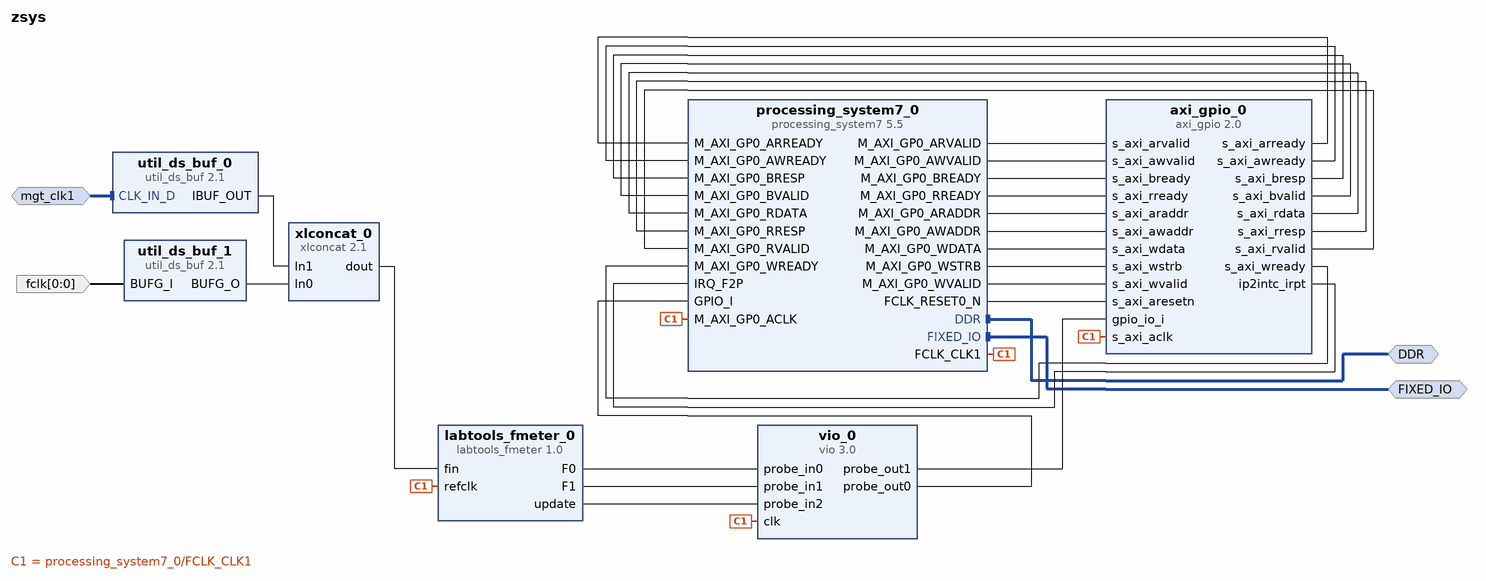
[diagram p0: block diagram of the top level]
# Vivado block design zsys, xc7z015clg485-1, Vivado 2017.2.1
create_bd_design zsys

create_bd_intf_port -mode Slave -vlnv xilinx.com:interface:diff_clock_rtl:1.0 mgt_clk1
set_property -dict {CONFIG.FREQ_HZ 125000000} [get_bd_intf_ports mgt_clk1]
create_bd_intf_port -mode Master -vlnv xilinx.com:interface:ddrx_rtl:1.0 DDR
create_bd_intf_port -mode Master -vlnv xilinx.com:display_processing_system7:fixedio_rtl:1.0 FIXED_IO
create_bd_port -dir I -from 0 -to 0 -type clk fclk
set_property -dict {CONFIG.FREQ_HZ 125000000} [get_bd_ports fclk]

create_bd_cell -type ip -vlnv trenz.biz:user:labtools_fmeter:1.0 labtools_fmeter_0
set_property -dict {CONFIG.C_CHANNELS 2} [get_bd_cells labtools_fmeter_0]
create_bd_cell -type ip -vlnv xilinx.com:ip:processing_system7:5.5 processing_system7_0
set_property -dict [list \
  CONFIG.PCW_FCLK_CLK1_BUF TRUE \
  CONFIG.PCW_I2C_PERIPHERAL_FREQMHZ 111.111115 \
  CONFIG.PCW_FPGA1_PERIPHERAL_FREQMHZ 100 \
  CONFIG.PCW_USE_AXI_NONSECURE 1 \
  CONFIG.PCW_USE_FABRIC_INTERRUPT 1 \
  CONFIG.PCW_EN_CLK1_PORT 1 \
  CONFIG.PCW_IRQ_F2P_INTR 1 \
  CONFIG.PCW_PRESET_BANK1_VOLTAGE {LVCMOS 1.8V} \
  CONFIG.PCW_UIPARAM_DDR_MEMORY_TYPE {DDR 3 (Low Voltage)} \
  CONFIG.PCW_UIPARAM_DDR_PARTNO {MT41J256M16 RE-125} \
  CONFIG.PCW_QSPI_PERIPHERAL_ENABLE 1 \
  CONFIG.PCW_QSPI_QSPI_IO {MIO 1 .. 6} \
  CONFIG.PCW_QSPI_GRP_SINGLE_SS_ENABLE 1 \
  CONFIG.PCW_QSPI_GRP_SINGLE_SS_IO {MIO 1 .. 6} \
  CONFIG.PCW_QSPI_GRP_FBCLK_ENABLE 1 \
  CONFIG.PCW_QSPI_GRP_FBCLK_IO {MIO 8} \
  CONFIG.PCW_ENET0_PERIPHERAL_ENABLE 1 \
  CONFIG.PCW_ENET0_ENET0_IO {MIO 16 .. 27} \
  CONFIG.PCW_ENET0_GRP_MDIO_ENABLE 1 \
  CONFIG.PCW_ENET0_GRP_MDIO_IO {MIO 52 .. 53} \
  CONFIG.PCW_ENET_RESET_ENABLE 1 \
  CONFIG.PCW_ENET_RESET_SELECT {Share reset pin} \
  CONFIG.PCW_ENET0_RESET_ENABLE 1 \
  CONFIG.PCW_ENET0_RESET_IO {MIO 50} \
  CONFIG.PCW_SD0_PERIPHERAL_ENABLE 1 \
  CONFIG.PCW_SD0_SD0_IO {MIO 40 .. 45} \
  CONFIG.PCW_UART0_PERIPHERAL_ENABLE 1 \
  CONFIG.PCW_UART0_UART0_IO {MIO 14 .. 15} \
  CONFIG.PCW_UART1_PERIPHERAL_ENABLE 0 \
  CONFIG.PCW_TTC0_PERIPHERAL_ENABLE 1 \
  CONFIG.PCW_TTC0_TTC0_IO EMIO \
  CONFIG.PCW_TTC1_PERIPHERAL_ENABLE 1 \
  CONFIG.PCW_TTC1_TTC1_IO EMIO \
  CONFIG.PCW_USB0_PERIPHERAL_ENABLE 1 \
  CONFIG.PCW_USB0_USB0_IO {MIO 28 .. 39} \
  CONFIG.PCW_USB_RESET_ENABLE 1 \
  CONFIG.PCW_USB_RESET_SELECT {Share reset pin} \
  CONFIG.PCW_USB0_RESET_ENABLE 1 \
  CONFIG.PCW_USB0_RESET_IO {MIO 51} \
  CONFIG.PCW_I2C0_PERIPHERAL_ENABLE 1 \
  CONFIG.PCW_I2C0_I2C0_IO EMIO \
  CONFIG.PCW_I2C1_PERIPHERAL_ENABLE 1 \
  CONFIG.PCW_I2C1_I2C1_IO {MIO 48 .. 49} \
  CONFIG.PCW_I2C1_GRP_INT_ENABLE 1 \
  CONFIG.PCW_I2C1_GRP_INT_IO EMIO \
  CONFIG.PCW_I2C_RESET_ENABLE 1 \
  CONFIG.PCW_I2C_RESET_SELECT {Share reset pin} \
  CONFIG.PCW_GPIO_MIO_GPIO_ENABLE 1 \
  CONFIG.PCW_GPIO_MIO_GPIO_IO MIO \
  CONFIG.PCW_GPIO_EMIO_GPIO_ENABLE 1 \
  CONFIG.PCW_GPIO_EMIO_GPIO_IO 8 \
  CONFIG.PCW_FPGA_FCLK1_ENABLE 1 \
] [get_bd_cells processing_system7_0]
# 187 more settings of processing_system7_0 are not shown: defaults, MIO pin electricals, DDR timing, and values the tool derives
create_bd_cell -type ip -vlnv xilinx.com:ip:util_ds_buf:2.1 util_ds_buf_0
set_property -dict {CONFIG.USE_BOARD_FLOW true CONFIG.DIFF_CLK_IN_BOARD_INTERFACE mgt_clk1} [get_bd_cells util_ds_buf_0]
create_bd_cell -type ip -vlnv xilinx.com:ip:util_ds_buf:2.1 util_ds_buf_1
set_property -dict {CONFIG.C_BUF_TYPE BUFG} [get_bd_cells util_ds_buf_1]
create_bd_cell -type ip -vlnv xilinx.com:ip:vio:3.0 vio_0
set_property -dict [list \
  CONFIG.C_PROBE_OUT1_WIDTH 8 \
  CONFIG.C_PROBE_OUT0_WIDTH 8 \
  CONFIG.C_NUM_PROBE_OUT 2 \
  CONFIG.C_NUM_PROBE_IN 3 \
] [get_bd_cells vio_0]
create_bd_cell -type ip -vlnv xilinx.com:ip:xlconcat:2.1 xlconcat_0
create_bd_cell -type ip -vlnv xilinx.com:ip:axi_gpio:2.0 axi_gpio_0
set_property -dict [list \
  CONFIG.C_GPIO_WIDTH 8 \
  CONFIG.C_IS_DUAL 0 \
  CONFIG.C_ALL_INPUTS 1 \
  CONFIG.C_INTERRUPT_PRESENT 1 \
] [get_bd_cells axi_gpio_0]

# ---- connections ----

connect_bd_intf_net -intf_net mgt_clk1_1 [get_bd_intf_ports mgt_clk1] [get_bd_intf_pins util_ds_buf_0/CLK_IN_D]
connect_bd_intf_net [get_bd_intf_ports DDR] [get_bd_intf_pins processing_system7_0/DDR]
connect_bd_intf_net [get_bd_intf_ports FIXED_IO] [get_bd_intf_pins processing_system7_0/FIXED_IO]
connect_bd_net -net BUFG_I_1 [get_bd_ports fclk] [get_bd_pins util_ds_buf_1/BUFG_I]
connect_bd_net -net fm_fclk125 [get_bd_pins labtools_fmeter_0/F0] [get_bd_pins vio_0/probe_in0]
connect_bd_net -net fm_mgt1 [get_bd_pins labtools_fmeter_0/F1] [get_bd_pins vio_0/probe_in1]
connect_bd_net [get_bd_pins labtools_fmeter_0/update] [get_bd_pins vio_0/probe_in2]
connect_bd_net [get_bd_pins processing_system7_0/FCLK_CLK1] \
  [get_bd_pins labtools_fmeter_0/refclk] [get_bd_pins vio_0/clk] [get_bd_pins processing_system7_0/M_AXI_GP0_ACLK] \
  [get_bd_pins axi_gpio_0/s_axi_aclk]
connect_bd_net [get_bd_pins util_ds_buf_0/IBUF_OUT] [get_bd_pins xlconcat_0/In1]
connect_bd_net [get_bd_pins util_ds_buf_1/BUFG_O] [get_bd_pins xlconcat_0/In0]
connect_bd_net [get_bd_pins xlconcat_0/dout] [get_bd_pins labtools_fmeter_0/fin]
connect_bd_net [get_bd_pins vio_0/probe_out0] [get_bd_pins processing_system7_0/GPIO_I]
connect_bd_net [get_bd_pins processing_system7_0/M_AXI_GP0_ARVALID] [get_bd_pins axi_gpio_0/s_axi_arvalid]
connect_bd_net [get_bd_pins processing_system7_0/M_AXI_GP0_AWVALID] [get_bd_pins axi_gpio_0/s_axi_awvalid]
connect_bd_net [get_bd_pins processing_system7_0/M_AXI_GP0_BREADY] [get_bd_pins axi_gpio_0/s_axi_bready]
connect_bd_net [get_bd_pins processing_system7_0/M_AXI_GP0_RREADY] [get_bd_pins axi_gpio_0/s_axi_rready]
connect_bd_net [get_bd_pins processing_system7_0/M_AXI_GP0_ARADDR] [get_bd_pins axi_gpio_0/s_axi_araddr]
connect_bd_net [get_bd_pins axi_gpio_0/s_axi_arready] [get_bd_pins processing_system7_0/M_AXI_GP0_ARREADY]
connect_bd_net [get_bd_pins processing_system7_0/M_AXI_GP0_AWADDR] [get_bd_pins axi_gpio_0/s_axi_awaddr]
connect_bd_net [get_bd_pins axi_gpio_0/s_axi_awready] [get_bd_pins processing_system7_0/M_AXI_GP0_AWREADY]
connect_bd_net [get_bd_pins axi_gpio_0/s_axi_bresp] [get_bd_pins processing_system7_0/M_AXI_GP0_BRESP]
connect_bd_net [get_bd_pins axi_gpio_0/s_axi_bvalid] [get_bd_pins processing_system7_0/M_AXI_GP0_BVALID]
connect_bd_net [get_bd_pins axi_gpio_0/s_axi_rdata] [get_bd_pins processing_system7_0/M_AXI_GP0_RDATA]
connect_bd_net [get_bd_pins axi_gpio_0/s_axi_rresp] [get_bd_pins processing_system7_0/M_AXI_GP0_RRESP]
connect_bd_net [get_bd_pins axi_gpio_0/s_axi_rvalid] [get_bd_pins processing_system7_0/M_AXI_GP0_RVALID]
connect_bd_net [get_bd_pins processing_system7_0/M_AXI_GP0_WDATA] [get_bd_pins axi_gpio_0/s_axi_wdata]
connect_bd_net [get_bd_pins axi_gpio_0/s_axi_wready] [get_bd_pins processing_system7_0/M_AXI_GP0_WREADY]
connect_bd_net [get_bd_pins processing_system7_0/M_AXI_GP0_WSTRB] [get_bd_pins axi_gpio_0/s_axi_wstrb]
connect_bd_net [get_bd_pins processing_system7_0/M_AXI_GP0_WVALID] [get_bd_pins axi_gpio_0/s_axi_wvalid]
connect_bd_net [get_bd_pins processing_system7_0/FCLK_RESET0_N] [get_bd_pins axi_gpio_0/s_axi_aresetn]
connect_bd_net [get_bd_pins axi_gpio_0/ip2intc_irpt] [get_bd_pins processing_system7_0/IRQ_F2P]
connect_bd_net [get_bd_pins vio_0/probe_out1] [get_bd_pins axi_gpio_0/gpio_io_i]

validate_bd_design
save_bd_design
